# EAGLE schematic cartreader (EAGLE 7.6.0)
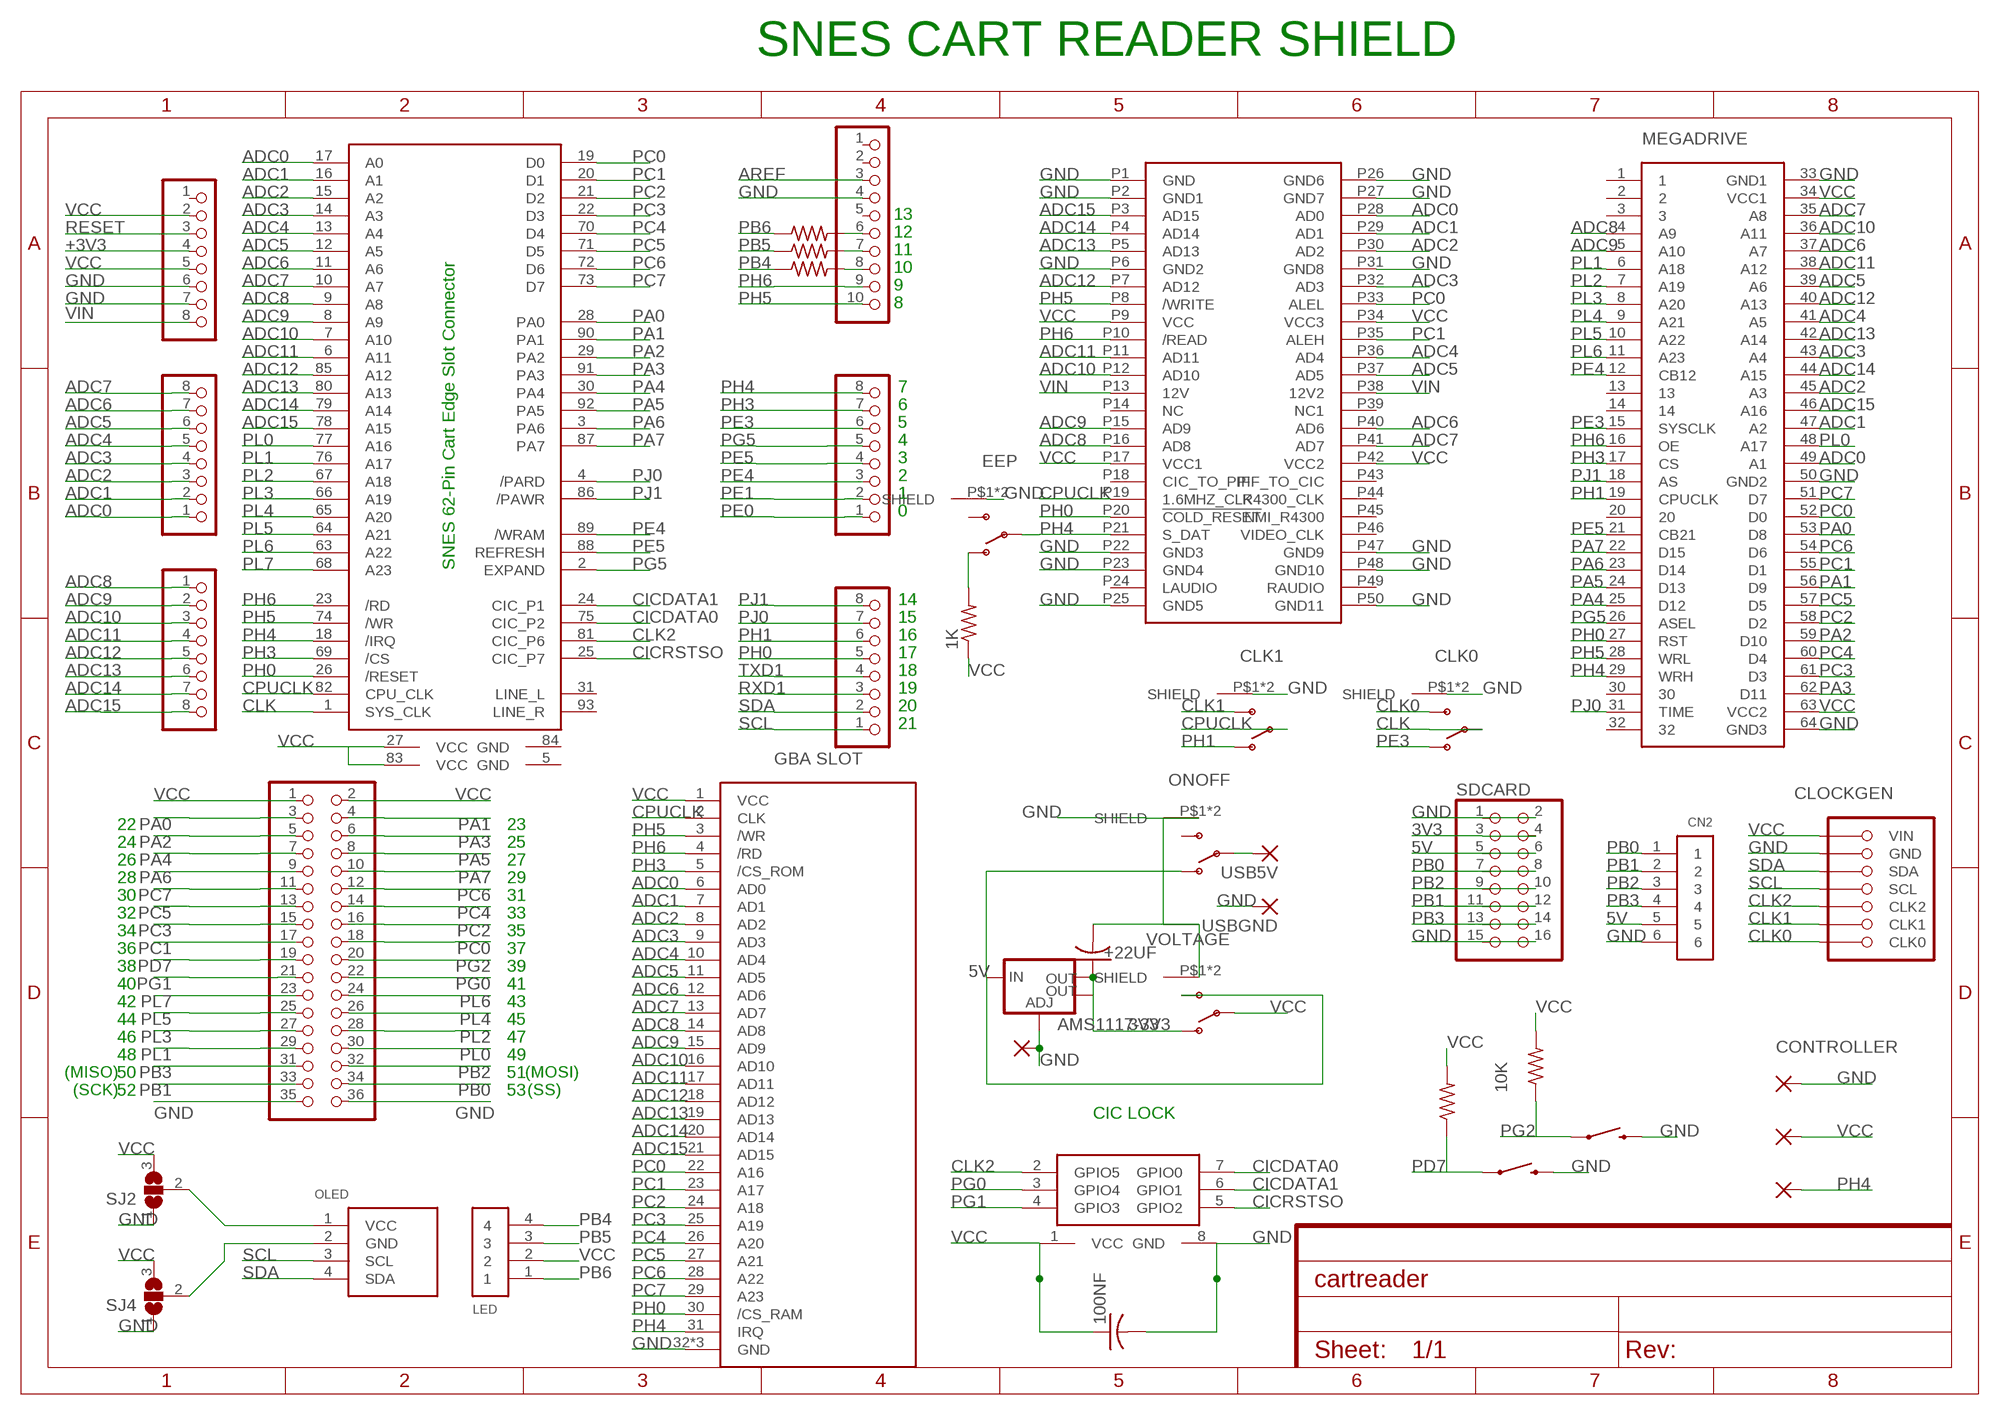
[diagram p0: schematic, sheet 1]

## Parts
1K  R-US_M1206  [M1206]
10K  R-US_M1206  [M1206]
100NF  C-USC1206  [C1206]
220R  R-US_M1206  [M1206]
1000R  R-US_M1206  [M1206]
+22UF  C-USC1206  [C1206]
ADCH  8x1F-H8.5  PINHD-1X8  [1X08]
ADCL  8x1F-H8.5  PINHD-1X8  [1X08]
AMS1117-3V3  SMD-AMS1117SOT223  [SOT223]
CIC  PIC12F629_SIMPLE  [PIC12F629]
CLK0  SWITCH-SPDT-2MMPTH  [SWITCH-SPDT-2MM]
CLK1  SWITCH-SPDT-2MMPTH  [SWITCH-SPDT-2MM]
CLOCKGEN  CLOCKGEN_2.54  [CLOCKGEN]
CN2  THT-PINHEADER_1X6-CLEANBIG  [1X06-CLEANBIG]
COMMUNICATION  8x1F-H8.5  PINHD-1X8  [1X08]
CONTROLLER  SMD-SOLDER_PAD  [SMD1,27-2,54]
EEP  SWITCH-SPDT-2MMPTH  [SWITCH-SPDT-2MM]
LED  THT-PINHEADER_1X4_2MM-CLEANBIG  [1X04-CLEANSMALL]
MEGADRIVE  MD-CART_SLOT  [MD-CART_SLOT]
OLED  OLED_I2C-CLEANBIG  [OLED_I2C]
ONOFF  SWITCH-SPDT-2MMPTH  [SWITCH-SPDT-2MM]
PAD1  SMD-SOLDER_PAD  [SMD1,27-2,54]
PAD2  SMD-SOLDER_PAD  [SMD1,27-2,54]
PAD3  SMD-SOLDER_PAD  [SMD1,27-2,54]
PINS  10x1F-H8.5  PINHD-1X10_ARD  [1X10]
POWER  8x1F-H8.5  PINHD-1X8  [1X08]
PWML  8x1F-H8.5  PINHD-1X8  [1X08]
R19  R-US_M1206  [M1206]
R20  R-US_M1206  [M1206]
S1  MOMENTARY-SWITCH-SPST-SMD-5.2MM  [TACTILE_SWITCH_SMD_5.2MM]
S2  MOMENTARY-SWITCH-SPST-SMD-5.2MM  [TACTILE_SWITCH_SMD_5.2MM]
SDCARD  PINHD-2X8_2.54  [2X08]
SJ2  SJ2W  [SJ_2]
SJ4  SJ2W  [SJ_2]
U$1  SNESCART_CONN_CLONE  [SNESCART_CONN_CLONE]
U$2  N64-CART_SLOT_4  [N64-CART_SLOT_4]
U$4  GBA-SLOT-BSMD  [GBA-SLOT-B]
USB5V  SMD-SOLDER_PAD  [SMD1,27-2,54]
USBGND  SMD-SOLDER_PAD  [SMD1,27-2,54]
VOLTAGE  SWITCH-SPDT-2MMPTH  [SWITCH-SPDT-2MM]
XIO  18x2F-H8.5  PINHD-2X18  [2X18]

## Nets
3V3 [power usb]: +22UF.1 AMS1117-3V3.2(OUT) AMS1117-3V3.4(OUT) SDCARD.3 SDCARD.4 VOLTAGE.1(O)
5V [power usb]: AMS1117-3V3.3(IN) CN2.5 ONOFF.1(O) SDCARD.5 SDCARD.6 VOLTAGE.3(S)
+3V3 [power]: POWER.4
ADC0: ADCL.1 MEGADRIVE.49(A1) U$1.17(A0) U$2.P28(AD0) U$4.6(AD0)
ADC1: ADCL.2 MEGADRIVE.47(A2) U$1.16(A1) U$2.P29(AD1) U$4.7(AD1)
ADC2: ADCL.3 MEGADRIVE.45(A3) U$1.15(A2) U$2.P30(AD2) U$4.8(AD2)
ADC3: ADCL.4 MEGADRIVE.43(A4) U$1.14(A3) U$2.P32(AD3) U$4.9(AD3)
ADC4: ADCL.5 MEGADRIVE.41(A5) U$1.13(A4) U$2.P36(AD4) U$4.10(AD4)
ADC5: ADCL.6 MEGADRIVE.39(A6) U$1.12(A5) U$2.P37(AD5) U$4.11(AD5)
ADC6: ADCL.7 MEGADRIVE.37(A7) U$1.11(A6) U$2.P40(AD6) U$4.12(AD6)
ADC7: ADCL.8 MEGADRIVE.35(A8) U$1.10(A7) U$2.P41(AD7) U$4.13(AD7)
ADC8: ADCH.1 MEGADRIVE.4(A9) U$1.9(A8) U$2.P16(AD8) U$4.14(AD8)
ADC9: ADCH.2 MEGADRIVE.5(A10) U$1.8(A9) U$2.P15(AD9) U$4.15(AD9)
ADC10: ADCH.3 MEGADRIVE.36(A11) U$1.7(A10) U$2.P12(AD10) U$4.16(AD10)
ADC11: ADCH.4 MEGADRIVE.38(A12) U$1.6(A11) U$2.P11(AD11) U$4.17(AD11)
ADC12: ADCH.5 MEGADRIVE.40(A13) U$1.85(A12) U$2.P7(AD12) U$4.18(AD12)
ADC13: ADCH.6 MEGADRIVE.42(A14) U$1.80(A13) U$2.P5(AD13) U$4.19(AD13)
ADC14: ADCH.7 MEGADRIVE.44(A15) U$1.79(A14) U$2.P4(AD14) U$4.20(AD14)
ADC15: ADCH.8 MEGADRIVE.46(A16) U$1.78(A15) U$2.P3(AD15) U$4.21(AD15)
AREF: PINS.3
CICDATA0: CIC.7(GPIO0) U$1.75(CIC_P2)
CICDATA1: CIC.6(GPIO1) U$1.24(CIC_P1)
CICRSTSO: CIC.5(GPIO2) U$1.25(CIC_P7)
CLK: CLK0.2(P) U$1.1(SYS_CLK)
CLK0: CLK0.3(S) CLOCKGEN.7(CLK0)
CLK1: CLK1.3(S) CLOCKGEN.6(CLK1)
CLK2: CIC.2(GPIO5) CLOCKGEN.5(CLK2) U$1.81(CIC_P6)
CPUCLK: CLK1.2(P) U$1.82(CPU_CLK) U$2.P19(1.6MHZ_CLK) U$4.2(CLK)
GND [gnd]: 100NF.2 +22UF.2 AMS1117-3V3.1(ADJ) CIC.8(GND) CLK0.P$1(SHIELD) CLK0.P$2(SHIELD) CLK1.P$1(SHIELD) CLK1.P$2(SHIELD) CLOCKGEN.2(GND) CN2.6 EEP.P$1(SHIELD) EEP.P$2(SHIELD) MEGADRIVE.33(GND1) MEGADRIVE.50(GND2) MEGADRIVE.64(GND3) ONOFF.P$1(SHIELD) ONOFF.P$2(SHIELD) PAD1.1(P) PAD2.1(P) PINS.4 POWER.6 POWER.7 S1.3 S2.3 SDCARD.1 SDCARD.2 SDCARD.15 SDCARD.16 SJ2.1 SJ4.1 U$2.P1(GND) U$2.P2(GND1) U$2.P6(GND2) U$2.P22(GND3) U$2.P23(GND4) U$2.P25(GND5) U$2.P26(GND6) U$2.P27(GND7) U$2.P31(GND8) U$2.P47(GND9) U$2.P48(GND10) U$2.P50(GND11) U$4.32(GND) U$4.SHIELD_3(GND) U$4.SHIELD_4(GND) USBGND.1(P) VOLTAGE.P$1(SHIELD) VOLTAGE.P$2(SHIELD) XIO.35 XIO.36
N$1: 1K.2 EEP.1(O)
N$2 [power usb]: ONOFF.2(P) USB5V.1(P)
N$8: OLED.1(VCC) SJ2.2
N$9: OLED.2(GND) SJ4.2
N$56: 220R.2 PINS.6
N$57: PINS.7 R19.2
N$58: PINS.8 R20.2
PA0: MEGADRIVE.53(D8) U$1.28(PA0) XIO.3
PA1: MEGADRIVE.56(D9) U$1.90(PA1) XIO.4
PA2: MEGADRIVE.59(D10) U$1.29(PA2) XIO.5
PA3: MEGADRIVE.62(D11) U$1.91(PA3) XIO.6
PA4: MEGADRIVE.25(D12) U$1.30(PA4) XIO.7
PA5: MEGADRIVE.24(D13) U$1.92(PA5) XIO.8
PA6: MEGADRIVE.23(D14) U$1.3(PA6) XIO.9
PA7: MEGADRIVE.22(D15) U$1.87(PA7) XIO.10
PB0: CN2.1 SDCARD.7 SDCARD.8 XIO.34
PB1: CN2.2 SDCARD.11 SDCARD.12 XIO.33
PB2: CN2.3 SDCARD.9 SDCARD.10 XIO.32
PB3: CN2.4 SDCARD.13 SDCARD.14 XIO.31
PB4: LED.4 R20.1
PB5: LED.3 R19.1
PB6: 220R.1 LED.1
PC0: MEGADRIVE.52(D0) U$1.19(D0) U$2.P33(ALEL) U$4.22(A16) XIO.18
PC1: MEGADRIVE.55(D1) U$1.20(D1) U$2.P35(ALEH) U$4.23(A17) XIO.17
PC2: MEGADRIVE.58(D2) U$1.21(D2) U$4.24(A18) XIO.16
PC3: MEGADRIVE.61(D3) U$1.22(D3) U$4.25(A19) XIO.15
PC4: MEGADRIVE.60(D4) U$1.70(D4) U$4.26(A20) XIO.14
PC5: MEGADRIVE.57(D5) U$1.71(D5) U$4.27(A21) XIO.13
PC6: MEGADRIVE.54(D6) U$1.72(D6) U$4.28(A22) XIO.12
PC7: MEGADRIVE.51(D7) U$1.73(D7) U$4.29(A23) XIO.11
PD7: 10K.1 S1.1 XIO.19
PE0: PWML.1
PE1: PWML.2
PE3: CLK0.1(O) MEGADRIVE.15(SYSCLK) PWML.6
PE4: MEGADRIVE.12(CB12) PWML.3 U$1.89(/WRAM)
PE5: MEGADRIVE.21(CB21) PWML.4 U$1.88(REFRESH)
PG0: CIC.3(GPIO4) XIO.22
PG1: CIC.4(GPIO3) XIO.21
PG2: 1000R.1 S2.1 XIO.20
PG5: MEGADRIVE.26(ASEL) PWML.5 U$1.2(EXPAND)
PH0: COMMUNICATION.5 MEGADRIVE.27(RST) U$1.26(/RESET) U$2.P20(!COLD_RESET) U$4.30(/CS_RAM)
PH1: CLK1.1(O) COMMUNICATION.6 MEGADRIVE.19(CPUCLK)
PH3: MEGADRIVE.17(CS) PWML.7 U$1.69(/CS) U$4.5(/CS_ROM)
PH4: CONTROLLER.1(P) EEP.2(P) MEGADRIVE.29(WRH) PWML.8 U$1.18(/IRQ) U$2.P21(S_DAT) U$4.31(IRQ)
PH5: MEGADRIVE.28(WRL) PINS.10 U$1.74(/WR) U$2.P8(/WRITE) U$4.3(/WR)
PH6: MEGADRIVE.16(OE) PINS.9 U$1.23(/RD) U$2.P10(/READ) U$4.4(/RD)
PJ0: COMMUNICATION.7 MEGADRIVE.31(TIME) U$1.4(/PARD)
PJ1: COMMUNICATION.8 MEGADRIVE.18(AS) U$1.86(/PAWR)
PL0: MEGADRIVE.48(A17) U$1.77(A16) XIO.30
PL1: MEGADRIVE.6(A18) U$1.76(A17) XIO.29
PL2: MEGADRIVE.7(A19) U$1.67(A18) XIO.28
PL3: MEGADRIVE.8(A20) U$1.66(A19) XIO.27
PL4: MEGADRIVE.9(A21) U$1.65(A20) XIO.26
PL5: MEGADRIVE.10(A22) U$1.64(A21) XIO.25
PL6: MEGADRIVE.11(A23) U$1.63(A22) XIO.24
PL7: U$1.68(A23) XIO.23
RESET: POWER.3
RXD1: COMMUNICATION.3
SCL: CLOCKGEN.4(SCL) COMMUNICATION.1 OLED.3(SCL)
SDA: CLOCKGEN.3(SDA) COMMUNICATION.2 OLED.4(SDA)
TXD1: COMMUNICATION.4
VCC [power usb]: 1K.1 10K.2 100NF.1 1000R.2 CIC.1(VCC) CLOCKGEN.1(VIN) LED.2 MEGADRIVE.34(VCC1) MEGADRIVE.63(VCC2) PAD3.1(P) POWER.2 POWER.5 SJ2.3 SJ4.3 U$1.27(VCC) U$1.83(VCC) U$2.P9(VCC) U$2.P17(VCC1) U$2.P34(VCC3) U$2.P42(VCC2) U$4.1(VCC) VOLTAGE.2(P) XIO.1 XIO.2
VIN [power]: POWER.8 U$2.P13(12V) U$2.P38(12V2)
Unconnected: EEP.3(S) MEGADRIVE.1 MEGADRIVE.2 MEGADRIVE.3 MEGADRIVE.13 MEGADRIVE.14 MEGADRIVE.20 MEGADRIVE.30 MEGADRIVE.32 ONOFF.3(S) PINS.1 PINS.2 PINS.5 POWER.1 U$1.31(LINE_L) U$1.93(LINE_R) U$2.P14(NC) U$2.P18(CIC_TO_PIF) U$2.P24(LAUDIO) U$2.P39(NC1) U$2.P43(PIF_TO_CIC) U$2.P44(R4300_CLK) U$2.P45(NMI_R4300) U$2.P46(VIDEO_CLK) U$2.P49(RAUDIO)

## Notes on the sheet
- SNES CART READER SHIELD
- 13
- 12
- 11
- 10
- 9
- 8
- 7
- 6
- 5
- 4
- 3
- 2
- 1
- 0
- SNES 62-Pin Cart Edge Slot Connector
- 14
- 15
- 16
- 17
- 18
- 19
- 20
- 21
- 22 | 23
- 24 | 25
- 26 | 27
- 28 | 29
- 30 | 31
- 32 | 33
- 34 | 35
- 36 | 37
- 38 | 39
- 40 | 41
- 42 | 43
- 44 | 45
- 46 | 47
- 48 | 49
- (MISO) | 50 | 51 | (MOSI)
- (SCK) | 52 | 53 | (SS)
- CIC LOCK

## Power pins joined to a net without a drawn wire
GND: U$1.5(GND) U$1.84(GND)

## Library data of the parts
1K 10K 220R 1000R R19 R20 = adafruit:R-US_: RESISTOR, American symbol
100NF +22UF = adafruit:C-US: CAPACITOR, American symbol
ADCH ADCL COMMUNICATION POWER PWML = cartreadershield:PINHD-1X8: PIN HEADER
AMS1117-3V3 = !sanni:SMD-AMS1117: Voltage Regulator LM1117 Standard adjustable voltage regulator but in SMD form. Spark Fun Electronics SKU : COM-00595; PROD_ID: VREG-08170
CIC = cartreadershield:PIC12F629_SIMPLE
CLK0 CLK1 EEP ONOFF VOLTAGE = !sanni:SWITCH-SPDT-2MM: SPDT Switch Simple slide switch, Spark Fun Electronics SKU : COM-00102 DPDT SMT slide switch, AYZ0202, SWCH-08179; PROD_ID: SWCH-08261
CLOCKGEN = cartreadershield:CLOCKGEN: PIN HEADER
CN2 = !sanni_mod2:THT-PINHEADER_1X6: 3-pin connector
CONTROLLER PAD1-PAD3 USB5V USBGND = !sanni:SMD-SOLDER_PAD: SMD PAD
LED = !sanni_mod3:THT-PINHEADER_1X4_2MM: 3-pin connector
MEGADRIVE = !sanni:MD-CART_SLOT: Cartridge Connector
OLED = cartreadershield:OLED_I2C: 4-pin connector
PINS = cartreadershield:PINHD-1X10_ARD: PIN HEADER
S1 S2 = !sanni:MOMENTARY-SWITCH-SPST: Momentary Switch (Pushbutton) - SPST Normally-open (NO) SPST momentary switches (buttons, pushbuttons). Variants PTH-12MM - 12mm square, through-hole Momentary Pushbutton Switch - 12mm Square <https://www.sparkfun.com/products/9190> (COM-09190) PTH-6.0MM, PTH-6.0MM-KIT - 6.0mm square, through-hole Mini Pushbutton Switch <https://www.sparkfun.com/products/97> (COM-00097) KIT package intended for soldering kit's - only one side of pads' copper is exposed. PTH-RIGHT-ANGLE-KIT - Right-angle, through-hole Right Angle Tactile Button <https://www.sparkfun.com/products/10791> - Used on SparkFun BigTime Watch Kit <https://www.sparkfun.com/products/11734> SMD-12MM - 12mm square, surface-mount Tactile Button - SMD (12mm) <https://www.sparkfun.com/products/12993> (COM-12993) Used on SparkFun PicoBoard <https://www.sparkfun.com/products/11888> SMD-4.5MM - 4.5mm Square Trackball Switch Used on SparkFun Blackberry Trackballer Breakout <https://www.sparkfun.com/products/13169> SMD-4.6MMX2.8MM - 4.60mm x 2.80mm, surface mount Used on SparkFun SAMD21 Mini Breakout <https://www.sparkfun.com/products/13664> SMD-5.2MM, SMD-5.2-REDUNDANT - 5.2mm square, surface-mount Mini Pushbutton Switch - SMD <https://www.sparkfun.com/products/8720> (COM-08720) Used on Arduino Pro Mini <https://www.sparkfun.com/products/11114> REDUNDANT package connects both switch circuits together SMD-6.0X3.5MM - 6.0 x 3.5mm, surface mount Momentary Reset Switch SMD <https://www.sparkfun.com/products/8229> (COM-08229) SMD-6.2MM-TALL - 6.2mm square, surface mount Tactile Button - SMD (6mm) <https://www.sparkfun.com/products/12992> Used on SparkFun Digital Sandbox <https://www.sparkfun.com/products/12651> SMD-RIGHT-ANGLE - Right-angle, surface mount Used on SparkFun Block for Intel® Edison - Arduino <https://www.sparkfun.com/products/13036>; PROD_ID: SWCH-08247; SF_SKU: COM-08720
SDCARD = cartreadershield:PINHD-2X8: PIN HEADER
SJ2 SJ4 = cartreadershield:SJ2W: SMD solder JUMPER
U$1 = cartreadershieldX12:SNESCART_CONN_CLONE
U$2 = cartreadershieldX12:N64-CART_SLOT_4
U$4 = !sanni_mod3:GBA-SLOT-B
XIO = cartreadershield:PINHD-2X18: PIN HEADER

## Net classes
0 default: width 0.254 mm, drill 0.305 mm, clearance 0.203 mm
1 power: width 0.61 mm, drill 0.406 mm, clearance 0.203 mm
2 gnd: width 0.61 mm, drill 0.406 mm, clearance 0.203 mm
3 power usb: width 0.61 mm, drill 0.406 mm, clearance 0.203 mm